# Altium schematic sheet 02_ldo1v8.SchDoc
size A; SheetNumber: 7; SheetTotal: 17
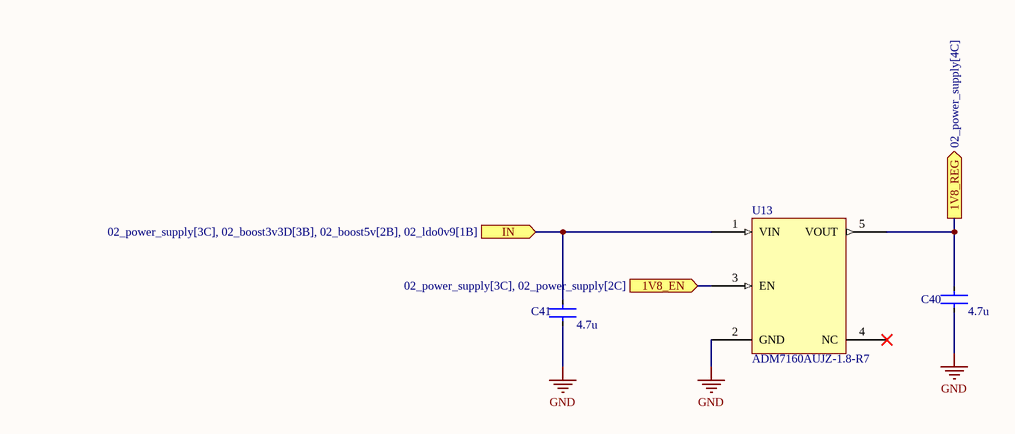
[diagram p0: 02_ldo1v8.SchDoc]

## Parts
C40  C1608X5R1E475K080AC  [CAPTDK0603]  (value not drawn)
C41  C1608X5R1E475K080AC  [CAPTDK0603]  (value not drawn)
U13  ADM7160AUJZ-1.8-R7  [ADM7160]

## Ports
1V8_EN (in, see 02_power_supply[3C], 02_power_supply[2C]), 1V8_REG (out, see 02_power_supply[4C]), IN (in, see 02_power_supply[3C], 02_boost3v3D[3B], 02_boost5v[2B], 02_ldo0v9[1B])

## Nets
GND: C40.2 C41.2 U13.2(GND)
1V8_EN: U13.3(EN) ; port 1V8_EN
1V8_REG: C40.1 U13.5(VOUT) ; port 1V8_REG
IN: C41.1 U13.1(VIN) ; port IN

Not connected (* = marked no-connect by the designer): U13 4(NC)*

## Notes on the sheet
- (in symbol C1608X5R1E475K080AC) 4.7u

## Library data of the parts
C40 C41 = C1608X5R1E475K080AC: CAP CER 4.7UF 25V X5R 0603; Supplier 1: Digi-Key; Supplier Part Number 1: 445-9050-1-ND
U13 = ADM7160AUJZ-1.8-R7: IC REG LINEAR 1.8V 200MA TSOT5; Manufacturer: Analog Devices; Number of Regulators: 1; Min Current Limit: 220mA; Polarity: Positive; Quiescent Current: 10uA; Min Input Voltage: 2.2V; Accuracy: 1%; Max Input Voltage: 5.5V; Power Supply Rejection Ratio (PSRR): 49dB; Max Supply Current: 265uA; Output Type: Fixed; Supplier 1: Digi-Key; Manufacturer Part Number: ADM7160AUJZ-1.8-R7; RoHS: Yes; Category: Voltage Regulators - Linear; Stock 1: 830; Pricing 1: 1=1.57000, 10=1.40700, 25=1.33560, 100=1.09710, 250=1.02556, 500=0.90630, 1000=0.71550 (USD); Mount: Surface Mount; Case/Package: TSOT; Number of Pins: 5; Contact Plating: Tin,Matte; Min Operating Temperature: -40°C; Max Operating Temperature: 125°C; Packaging: Tape and Reel; Output Voltage: 1.8V; Output Current: 200mA; Number of Outputs: 1; Max Output Current: 200mA; Lead Free: Contains Lead; RoHS Compliant: Yes; ComponentLink1URL: http://www.analog.com/static/imported-files/data_sheets/ADM7160.pdf?src-supplier=Avnet; ComponentLink1Description: http://www.analog.com/static/imported-files/data_sheets/ADM7160.pdf?src-supplier=Avnet; ComponentLink2URL: http://www.analog.com/media/en/technical-documentation/data-sheets/ADM7160.pdf?src-supplier=Digi-Key; ComponentLink2Description: http://www.analog.com/media/en/technical-documentation/data-sheets/ADM7160.pdf?src-supplier=Digi-Key; ComponentLink3URL: https://www.analog.com/media/en/technical-documentation/data-sheets/ADM7160.pdf?src-supplier=Digi-Key; ComponentLink3Description: https://www.analog.com/media/en/technical-documentation/data-sheets/ADM7160.pdf?src-supplier=Digi-Key; Supplier Part Number 1: ADM7160AUJZ-1.8-R7CT-ND